# EAGLE design BT AQ DOL R4 (EAGLE 9.6.2)
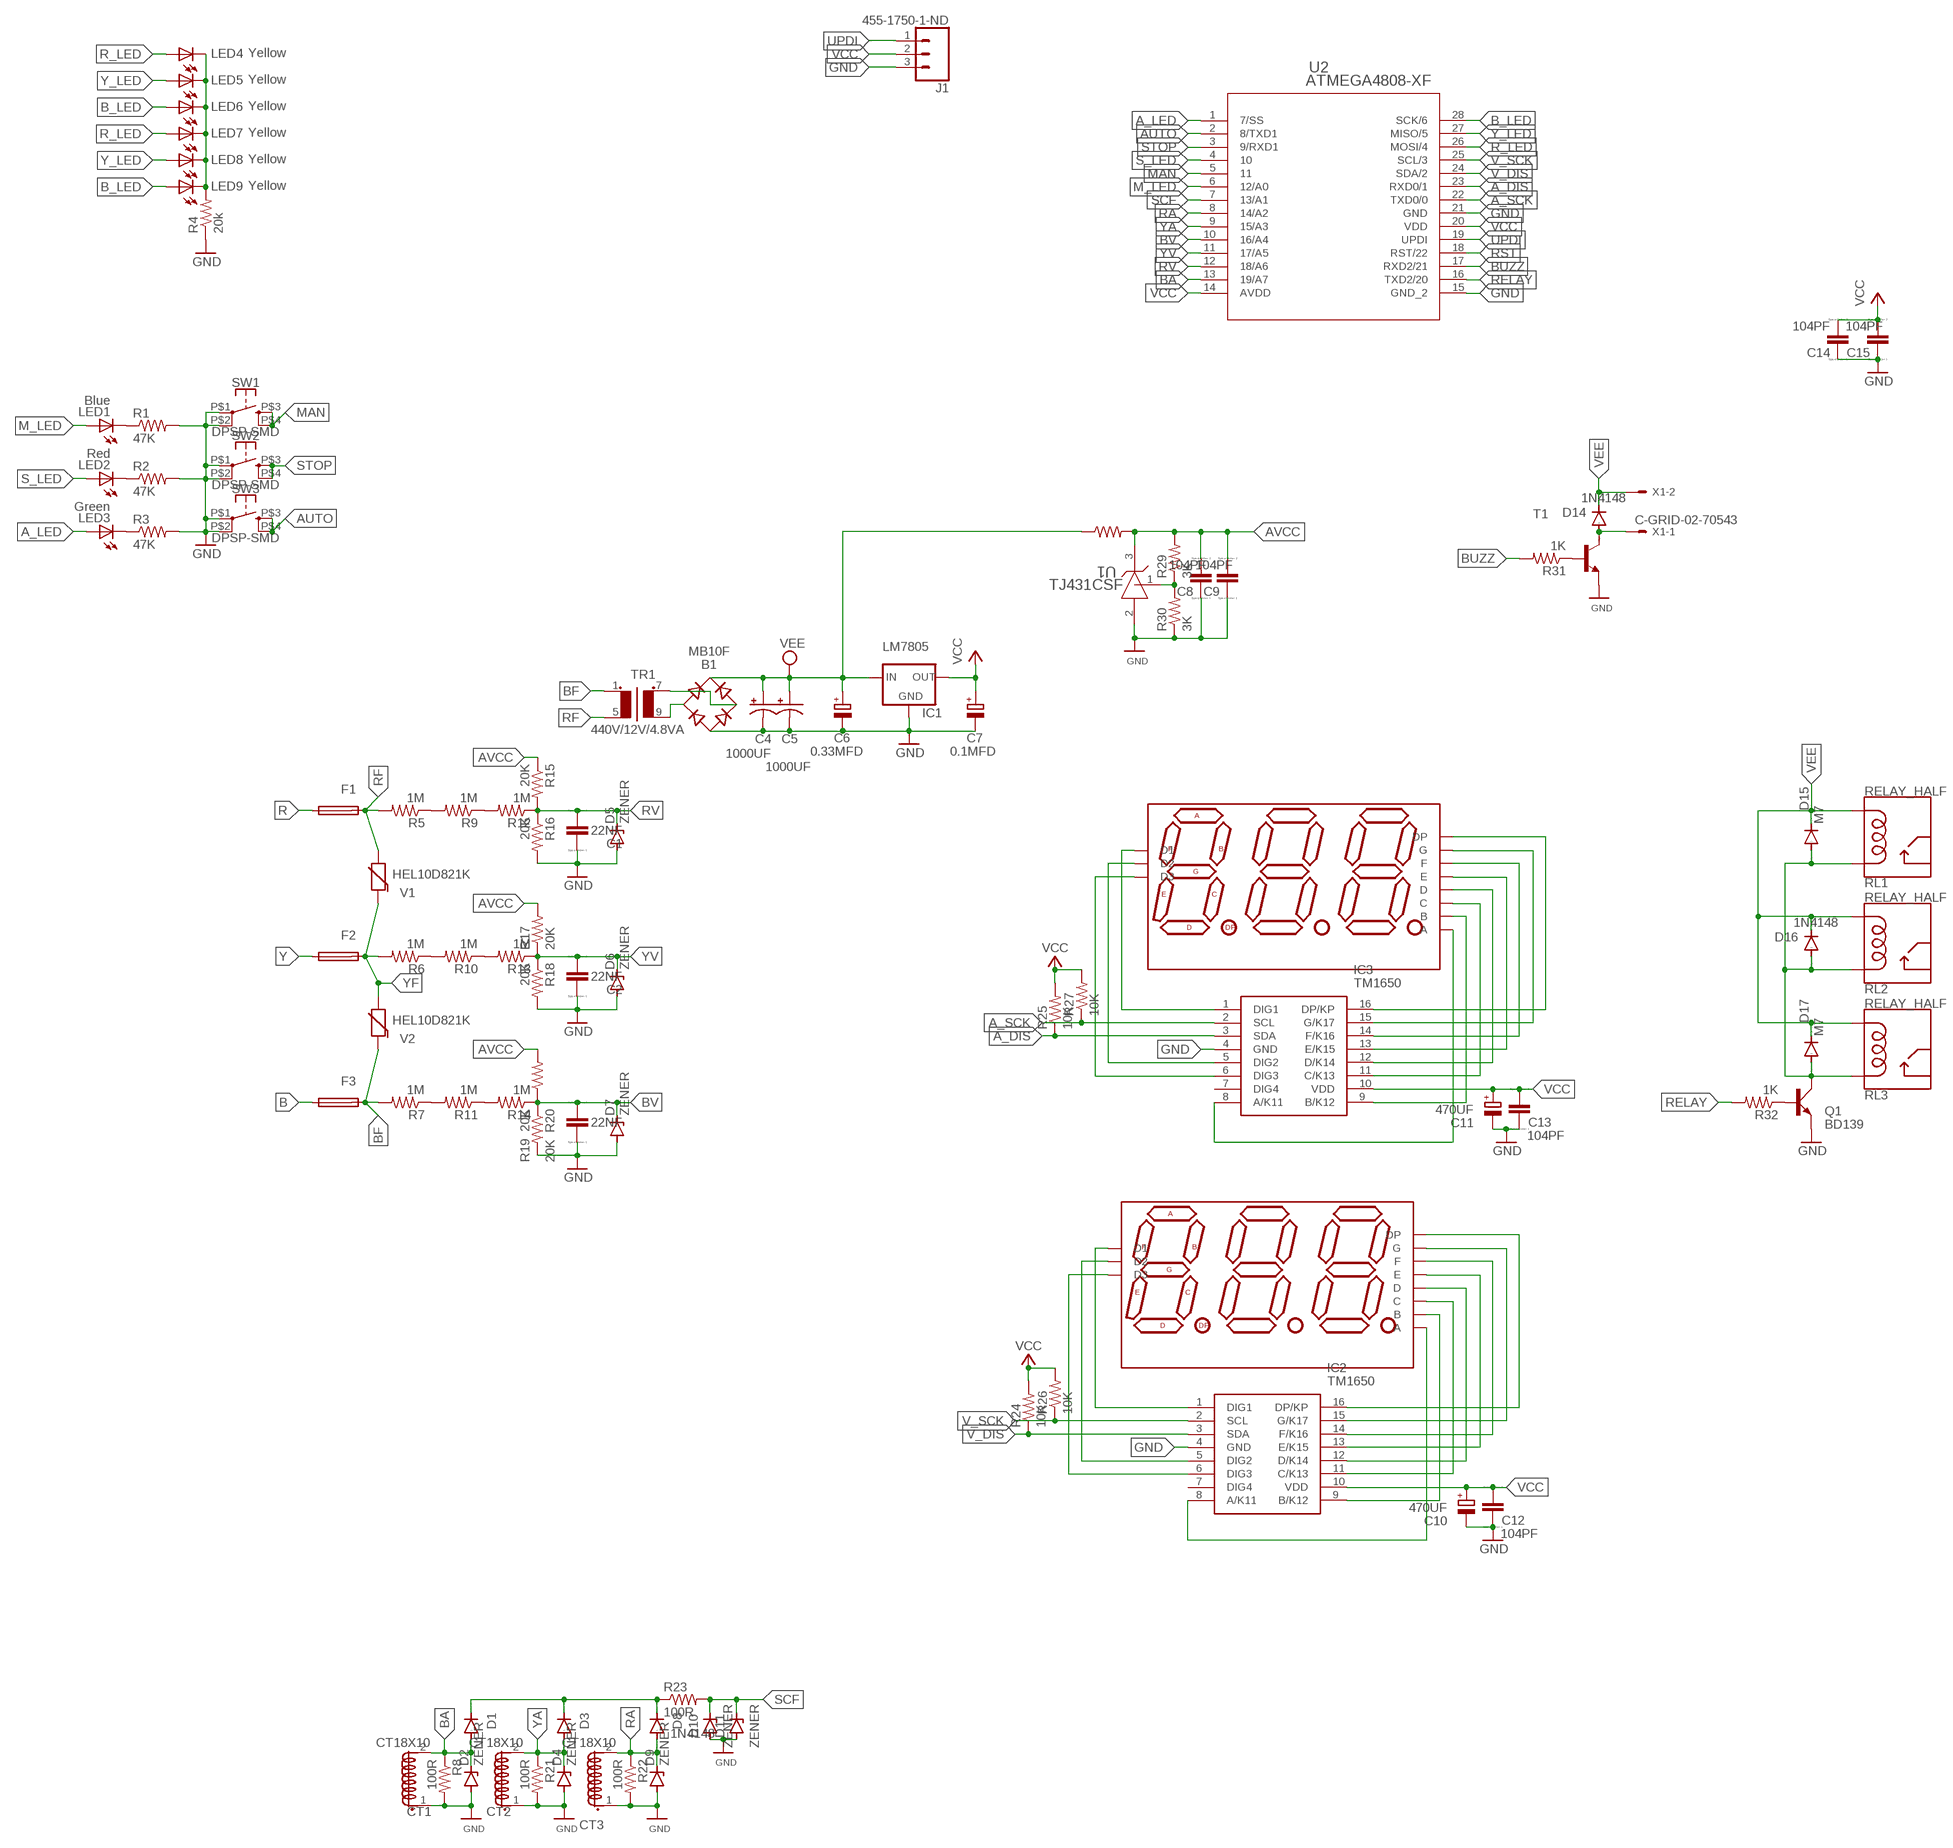
[diagram p0: schematic, sheet 1]

## Parts
B1  MB10F  MB8S  [SOIC-4]
C1  22NF  CC1206  [C1206]
C2  22NF  CC1206  [C1206]
C3  22NF  CC1206  [C1206]
C4  1000UF  CPOL-USE3.5-10  [E3,5-10]
C5  1000UF  CPOL-USE3.5-10  [E3,5-10]
C6  0.33MFD  CPOL-EUE2.5-5  [E2,5-5]
C7  0.1MFD  CPOL-EUE2.5-5  [E2,5-5]
C8  104PF  CC1206  [C1206]
C9  104PF  CC1206  [C1206]
C10  470UF  CPOL-EUE3.5-8  [E3,5-8]
C11  470UF  CPOL-EUE3.5-8  [E3,5-8]
C12  104PF  CC1206  [C1206]
C13  104PF  CC1206  [C1206]
C14  104PF  CC1206  [C1206]
C15  104PF  CC1206  [C1206]
CT1  CT18X10  [ZMCT103C]
CT2  CT18X10  [ZMCT103C]
CT3  CT18X10  [ZMCT103C]
D1  1N4148  DIODE-MINIMELF  [MINIMELF]
D2  ZENER  ZENER__DO-215-BA  [SOD6126X350]
D3  1N4148  DIODE-MINIMELF  [MINIMELF]
D4  ZENER  ZENER__DO-215-BA  [SOD6126X350]
D5  ZENER  ZENER__DO-215-BA  [SOD6126X350]
D6  ZENER  ZENER__DO-215-BA  [SOD6126X350]
D7  ZENER  ZENER__DO-215-BA  [SOD6126X350]
D8  1N4148  DIODE-MINIMELF  [MINIMELF]
D9  ZENER  ZENER__DO-215-BA  [SOD6126X350]
D10  ZENER  ZENER__DO-215-BA  [SOD6126X350]
D11  ZENER  ZENER__DO-213AA(SOD-80)  [DIOMELF3516]
D12  SUNR036CC3D  7SEGMENT-3DIGITDIP  [7S3D036_DIP]
D13  SUNR036CC3D  7SEGMENT-3DIGITDIP  [7S3D036_DIP]
D14  1N4148  DIODE-MINIMELF  [MINIMELF]
D15  M7  DIODE-DO-214AC  [DO-214AC]
D16  1N4148  DIODE-MINIMELF  [MINIMELF]
D17  M7  DIODE-DO-214AC  [DO-214AC]
F1  TRF600-150  PPTCPTH  [TRF600-150]
F2  TRF600-150  PPTCPTH  [TRF600-150]
F3  TRF600-150  PPTCPTH  [TRF600-150]
IC1  LM7805  78XXS  [78XXS]
IC2  TM1650  [SOIC127P604X185-16N]
IC3  TM1650  [SOIC127P604X185-16N]
J1  455-1750-1-ND  CONN_03  [1X03]
LED1  Blue  LED3MM  [LED3MM]
LED2  Red  LED3MM  [LED3MM]
LED3  Green  LED3MM  [LED3MM]
LED4  Yellow  LED3MM  [LED3MM]
LED5  Yellow  LED3MM  [LED3MM]
LED6  Yellow  LED3MM  [LED3MM]
LED7  Yellow  LED3MM  [LED3MM]
LED8  Yellow  LED3MM  [LED3MM]
LED9  Yellow  LED3MM  [LED3MM]
Q1  BD139  [TO126AV]
R1  47K  R-US_M1206  [M1206]
R2  47K  R-US_M1206  [M1206]
R3  47K  R-US_M1206  [M1206]
R4  20k  R-US_M1206  [M1206]
R5  1M  R-US_M1206  [M1206]
R6  1M  R-US_M1206  [M1206]
R7  1M  R-US_M1206  [M1206]
R8  100R  R-US_M1206  [M1206]
R9  1M  R-US_M1206  [M1206]
R10  1M  R-US_M1206  [M1206]
R11  1M  R-US_M1206  [M1206]
R12  1M  R-US_M1206  [M1206]
R13  1M  R-US_M1206  [M1206]
R14  1M  R-US_M1206  [M1206]
R15  20K  R-US_M1206  [M1206]
R16  20K  R-US_M1206  [M1206]
R17  20K  R-US_M1206  [M1206]
R18  20K  R-US_M1206  [M1206]
R19  20K  R-US_M1206  [M1206]
R20  20K  R-US_M1206  [M1206]
R21  100R  R-US_M1206  [M1206]
R22  100R  R-US_M1206  [M1206]
R23  100R  R-US_M1206  [M1206]
R24  10K  R-US_M1206  [M1206]
R25  10K  R-US_M1206  [M1206]
R26  10K  R-US_M1206  [M1206]
R27  10K  R-US_M1206  [M1206]
R28  10K  R-US_M1206  [M1206]
R29  3K  R-US_M1206  [M1206]
R30  3K  R-US_M1206  [M1206]
R31  1K  R-US_M1206  [M1206]
R32  1K  R-US_M1206  [M1206]
RL1  RELAY_HALF  [DT90_HALF]
RL2  RELAY_HALF  [DT90_HALF]
RL3  RELAY_HALF  [DT90_HALF]
SW1  DPSP-SMD  [B3F-40XX-ROUND-SMD]
SW2  DPSP-SMD  [B3F-40XX-ROUND-SMD]
SW3  DPSP-SMD  [B3F-40XX-ROUND-SMD]
T1  MMUN2213LT1-NPN-SC59-BEC  [SC59-BEC]
TR1  440V/12V/4.8VA  TRANSFORMER6VA  [440V12V6VA]
U1  TJ431CSF  TJ431CSFDBZ0003A_L  [SOT-23]
U2  ATMEGA4808-XF  [SSOP28_SS_MCH]
V1  HEL10D821K  VARISTOR  [10MM]
V2  HEL10D821K  VARISTOR  [10MM]
X1  C-GRID-02-70543  [70543-02]

## Nets
A_DIS: IC3.3(SDA) R25.1 U2.23(RXD0/1)
A_LED: LED3.A U2.1(7/SS)
A_SCK: IC3.2(SCL) R27.1 U2.22(TXD0/0)
AUTO: SW3.P$3 SW3.P$4 U2.2(8/TXD1)
AVCC: C8.2 C9.2 R15.1 R17.2 R19.2 R28.2 R29.2 U1.3(CATHODE)
B: F3.1
B_LED: LED6.A LED9.A U2.28(SCK/6)
BA: CT1.2(S1.2) D1.A D2.1(C) R8.1 U2.13(19/A7)
BF: F3.2 R7.2 TR1.1 V2.1
BUZZ: R31.2 U2.17(RXD2/21)
BV: C3.2 D7.1(C) R14.1 R19.1 R20.1 U2.10(16/A4)
GND: B1.- C1.1 C2.1 C3.1 C4.- C5.- C6.- C7.- C8.1 C9.1 C10.- C11.- C12.1 C13.1 C14.1 C15.1 CT1.1(S1.1) CT2.1(S1.1) CT3.1(S1.1) D2.2(A) D4.2(A) D5.2(A) D6.2(A) D7.2(A) D9.2(A) D10.2(A) D11.2(A) IC1.GND IC2.4(GND) IC3.4(GND) J1.3 Q1.E R1.2 R2.2 R3.2 R4.1 R8.2 R16.2 R18.2 R20.2 R21.2 R22.2 R30.1 SW1.P$1 SW1.P$2 SW2.P$1 SW2.P$2 SW3.P$1 SW3.P$2 T1.E U1.2(ANODE) U2.15(GND_2) U2.21(GND)
M_LED: LED1.A U2.6(12/A0)
MAN: SW1.P$3 SW1.P$4 U2.5
N$1: B1.~2(AC2) TR1.7(S1)
N$2: B1.~1(AC1) TR1.9(S2)
N$3: D14.A T1.C X1.1
N$4: R31.1 T1.B
N$5: LED3.K(C) R3.1
N$6: LED2.K(C) R2.1
N$8: LED1.K(C) R1.1
N$9: R29.1 R30.2 U1.1(REF)
N$10: LED4.K(C) LED5.K(C) LED6.K(C) LED7.K(C) LED8.K(C) LED9.K(C) R4.2
N$11: D1.C D3.C D8.C R23.1
N$13: R5.1 R9.2
N$14: R9.1 R12.2
N$15: R6.1 R10.2
N$18: R7.1 R11.2
N$19: R10.1 R13.2
N$22: Q1.B R32.1
N$23: R11.1 R14.2
N$28: D13.11(A) IC3.8(A/K11)
N$29: D13.7(B) IC3.9(B/K12)
N$30: D13.4(C) IC3.11(C/K13)
N$31: D13.2(D) IC3.12(D/K14)
N$32: D13.1(E) IC3.13(E/K15)
N$33: D13.10(F) IC3.14(F/K16)
N$34: D13.5(G) IC3.15(G/K17)
N$35: D13.3(DP) IC3.16(DP/KP)
N$36: D13.12(D1) IC3.1(DIG1)
N$37: D13.9(D2) IC3.5(DIG2)
N$38: D13.8(D3) IC3.6(DIG3)
N$39: D12.11(A) IC2.8(A/K11)
N$40: D12.7(B) IC2.9(B/K12)
N$41: D12.4(C) IC2.11(C/K13)
N$44: D12.2(D) IC2.12(D/K14)
N$48: D12.1(E) IC2.13(E/K15)
N$49: D12.10(F) IC2.14(F/K16)
N$50: D12.5(G) IC2.15(G/K17)
N$51: D12.3(DP) IC2.16(DP/KP)
N$52: D12.12(D1) IC2.1(DIG1)
N$53: D12.9(D2) IC2.5(DIG2)
N$54: D12.8(D3) IC2.6(DIG3)
N$121: D15.A D16.A D17.A Q1.C RL1.1(COIL1) RL2.1(COIL1) RL3.1(COIL1)
R: F1.1
R_LED: LED4.A LED7.A U2.26(MOSI/4)
RA: CT3.2(S1.2) D8.A D9.1(C) R22.1 U2.8(14/A2)
RELAY: R32.2 U2.16(TXD2/20)
RF: F1.2 R5.2 TR1.5(P2) V1.2
RST: U2.18(RST/22)
RV: C1.2 D5.1(C) R12.1 R15.2 R16.1 U2.12(18/A6)
S_LED: LED2.A U2.4
SCF: D10.1(C) D11.1(C) R23.2 U2.7(13/A1)
STOP: SW2.P$3 SW2.P$4 U2.3(9/RXD1)
UPDI: J1.1 U2.19(UPDI)
V_DIS: IC2.3(SDA) R24.1 U2.24(SDA/2)
V_SCK: IC2.2(SCL) R26.1 U2.25(SCL/3)
VCC: C7.+ C10.+ C11.+ C12.2 C13.2 C14.2 C15.2 IC1.OUT IC2.10(VDD) IC3.10(VDD) J1.2 R24.2 R25.2 R26.2 R27.2 U2.14(AVDD) U2.20(VDD)
VEE [VEE]: B1.+ C4.+ C5.+ C6.+ D14.C D15.C D16.C D17.C IC1.IN R28.1 RL1.2(COIL2) RL2.2(COIL2) RL3.2(COIL2) X1.2
Y: F2.1
Y_LED: LED5.A LED8.A U2.27(MISO/5)
YA: CT2.2(S1.2) D3.A D4.1(C) R21.1 U2.9(15/A3)
YF: F2.2 R6.2 V1.1 V2.2
YV: C2.2 D6.1(C) R13.1 R17.1 R18.1 U2.11(17/A5)
Unconnected: IC2.7(DIG4) IC3.7(DIG4)

## Library data of the parts
B1 = rectifier:MB*S: Bridge Rectifier Source: http://www.fairchildsemi.com/ds/MB/MB6S.pdf
C1-C3 C8 C9 C12-C15 = eagle-ltspice:C: CAPACITOR, European symbol; SPICEMODEL: NONE; SPICEPREFIX: C
C4 C5 = rcl:CPOL-US: POLARIZED CAPACITOR, American symbol; SPICEPREFIX: C
C6 C7 C10 C11 = rcl:CPOL-EU: POLARIZED CAPACITOR, European symbol; SPICEPREFIX: C
CT1-CT3 = User Components:CT
D1 D3 D8 D14-D17 = diode:DIODE-: DIODE
D2 D4-D7 D9-D11 = Tinkercad:ZENER: Zener Diode - Generic; CATEGORY: Diode; SUB-CATEGORY: Zener
D12 D13 = User Components:7SEGMENT-3DIGIT
F1-F3 = User Components:PPTC: FUSE Wickmann; OC_FARNELL: unknown; OC_NEWARK: unknown
IC1 = v-reg:78XXS: VOLTAGE REGULATOR
IC2 IC3 = User Components:TM1650: The TM1650 is a dedicated LED (LED display) drive control circuit with a keyboard scan interface. The MCU input and output control digital interface, data latch, LED driver, keyboard scan, brightness adjustment and other circuits are integrated inside. The TM1650's stable performance, reliable quality, and high immunity to interference make it suitable for long-term continuous operation in 24 hours Source: Datasheet <http://www.titanmec.com/index.php/en/product/download/id/540.html>; DESCRIPTION: The TM1650 is a dedicated LED (LED display) drive control circuit with a keyboard scan interface. The MCU input and output control digital interface, data latch, LED driver, keyboard scan, brightness adjustment and other circuits are integrated inside. The TM1650's stable performance, reliable quality, and high immunity to interference make it suitable for long-term continuous operation in 24 hours; HEIGHT: 1.85mm; MANUFACTURER_NAME: TITAN MICRO ELECTRONICS; MANUFACTURER_PART_NUMBER: tm1650
J1 = SparkFun-Connectors:CONN_03: Multi connection point. Often used as Generic Header-pin footprint for 0.1 inch spaced/style header connections On any of the 0.1 inch spaced packages, you can populate with these: Break Away Headers - Straight <https://www.sparkfun.com/products/116> (PRT-00116) Break Away Male Headers - Right Angle <https://www.sparkfun.com/products/553> (PRT-00553) Female Headers <https://www.sparkfun.com/products/115> (PRT-00115) Break Away Headers - Machine Pin <https://www.sparkfun.com/products/117> (PRT-00117) Break Away Female Headers - Swiss Machine Pin <https://www.sparkfun.com/products/743> (PRT-00743) Stackable Header - 3 Pin (Female, 0.1") <https://www.sparkfun.com/products/13875> (PRT-13875) For SCREWTERMINALS and SPRING TERMINALS visit here: Screw Terimnals on SparkFun.com <https://www.sparkfun.com/search/results?term=Screw+Terminals> (5mm/3.5mm/2.54mm spacing) This device is also useful as a general connection point to wire up your design to another part of your project. Our various solder wires solder well into these plated through hole pads. Hook-Up Wire - Assortment (Stranded, 22 AWG) <https://www.sparkfun.com/products/11375> (PRT-11375) Hook-Up Wire - Assortment (Solid Core, 22 AWG) <https://www.sparkfun.com/products/11367> (PRT-11367) View the entire wire category on our website here <https://www.sparkfun.com/categories/141> Special notes: Molex polarized connector foot print use with SKU : PRT-08232 with associated crimp pins and housings.; PROD_ID: XXX-00000
LED1-LED9 = adafruit:LED: LED OSRAM: - CHIPLED LG R971, LG N971, LY N971, LG Q971, LY Q971, LO R971, LY R971 LH N974, LH R974 LS Q976, LO Q976, LY Q976 LO Q996 - Hyper CHIPLED LW Q18S LB Q993, LB Q99A, LB R99A - SideLED LS A670, LO A670, LY A670, LG A670, LP A670 LB A673, LV A673, LT A673, LW A673 LH A674 LY A675 LS A676, LA A676, LO A676, LY A676, LW A676 LS A679, LY A679, LG A679 - Hyper Micro SIDELED® LS Y876, LA Y876, LO Y876, LY Y876 LT Y87S - SmartLED LW L88C, LW L88S LB L89C, LB L89S, LG L890 LS L89K, LO L89K, LY L89K LS L896, LA L896, LO L896, LY L896 - TOPLED LS T670, LO T670, LY T670, LG T670, LP T670 LSG T670, LSP T670, LSY T670, LOP T670, LYG T670 LG T671, LOG T671, LSG T671 LB T673, LV T673, LT T673, LW T673 LH T674 LS T676, LA T676, LO T676, LY T676, LB T676, LH T676, LSB T676, LW T676 LB T67C, LV T67C, LT T67C, LS T67K, LO T67K, LY T67K, LW E67C LS E67B, LA E67B, LO E67B, LY E67B, LB E67C, LV E67C, LT E67C LW T67C LS T679, LY T679, LG T679 LS T770, LO T770, LY T770, LG T770, LP T770 LB T773, LV T773, LT T773, LW T773 LH T774 LS E675, LA E675, LY E675, LS T675 LS T776, LA T776, LO T776, LY T776, LB T776 LHGB T686 LT T68C, LB T68C - Hyper Mini TOPLED® LB M676 - Mini TOPLED Santana® LG M470 LS M47K, LO M47K, LY M47K Source: http://www.osram.convergy.de/
Q1 = transistor-power:BD139: NPN TRANSISTOR
R1-R7 R9-R20 R24-R27 R31 R32 = rcl:R-US_: RESISTOR, American symbol; SPICEPREFIX: R
R8 R21-R23 R28-R30 = rcl:R-US_: RESISTOR, American symbol
RL1-RL3 = User Components:RELAY_HALF
SW1-SW3 = User Components:DPSP-SMD
T1 = transistor:*-NPN-: NPN Transistror BF959 corrected 2008.03.06
TR1 = User Components:TRANSFORMER
U1 = User Components:TJ431CSF; COPYRIGHT: Copyright (C) 2022 Ultra Librarian. All rights reserved.; MANUFACTURER_PART_NUMBER: TL431IDBZTG4; MFR_NAME: Texas Instruments; REFDES: RefDes; TYPE: TYPE
U2 = User Components:ATMEGA4808-XF; COPYRIGHT: Copyright (C) 2022 Ultra Librarian. All rights reserved.; MANUFACTURER_PART_NUMBER: ATMEGA4808-XF; MFR_NAME: Microchip
V1 V2 = User Components:VARISTOR
X1 = con-molex:C-GRID-02: CONNECTOR wire to board 2.54 mm (0.100") pitch header; MF: MOLEX; OC_FARNELL: unknown; OC_NEWARK: unknown

## Net classes
0 default: width 0.254 mm, drill 0.508 mm, clearance 0.381 mm
1 VEE: width 0.762 mm, drill 0.508 mm, clearance 0.508 mm

## Board
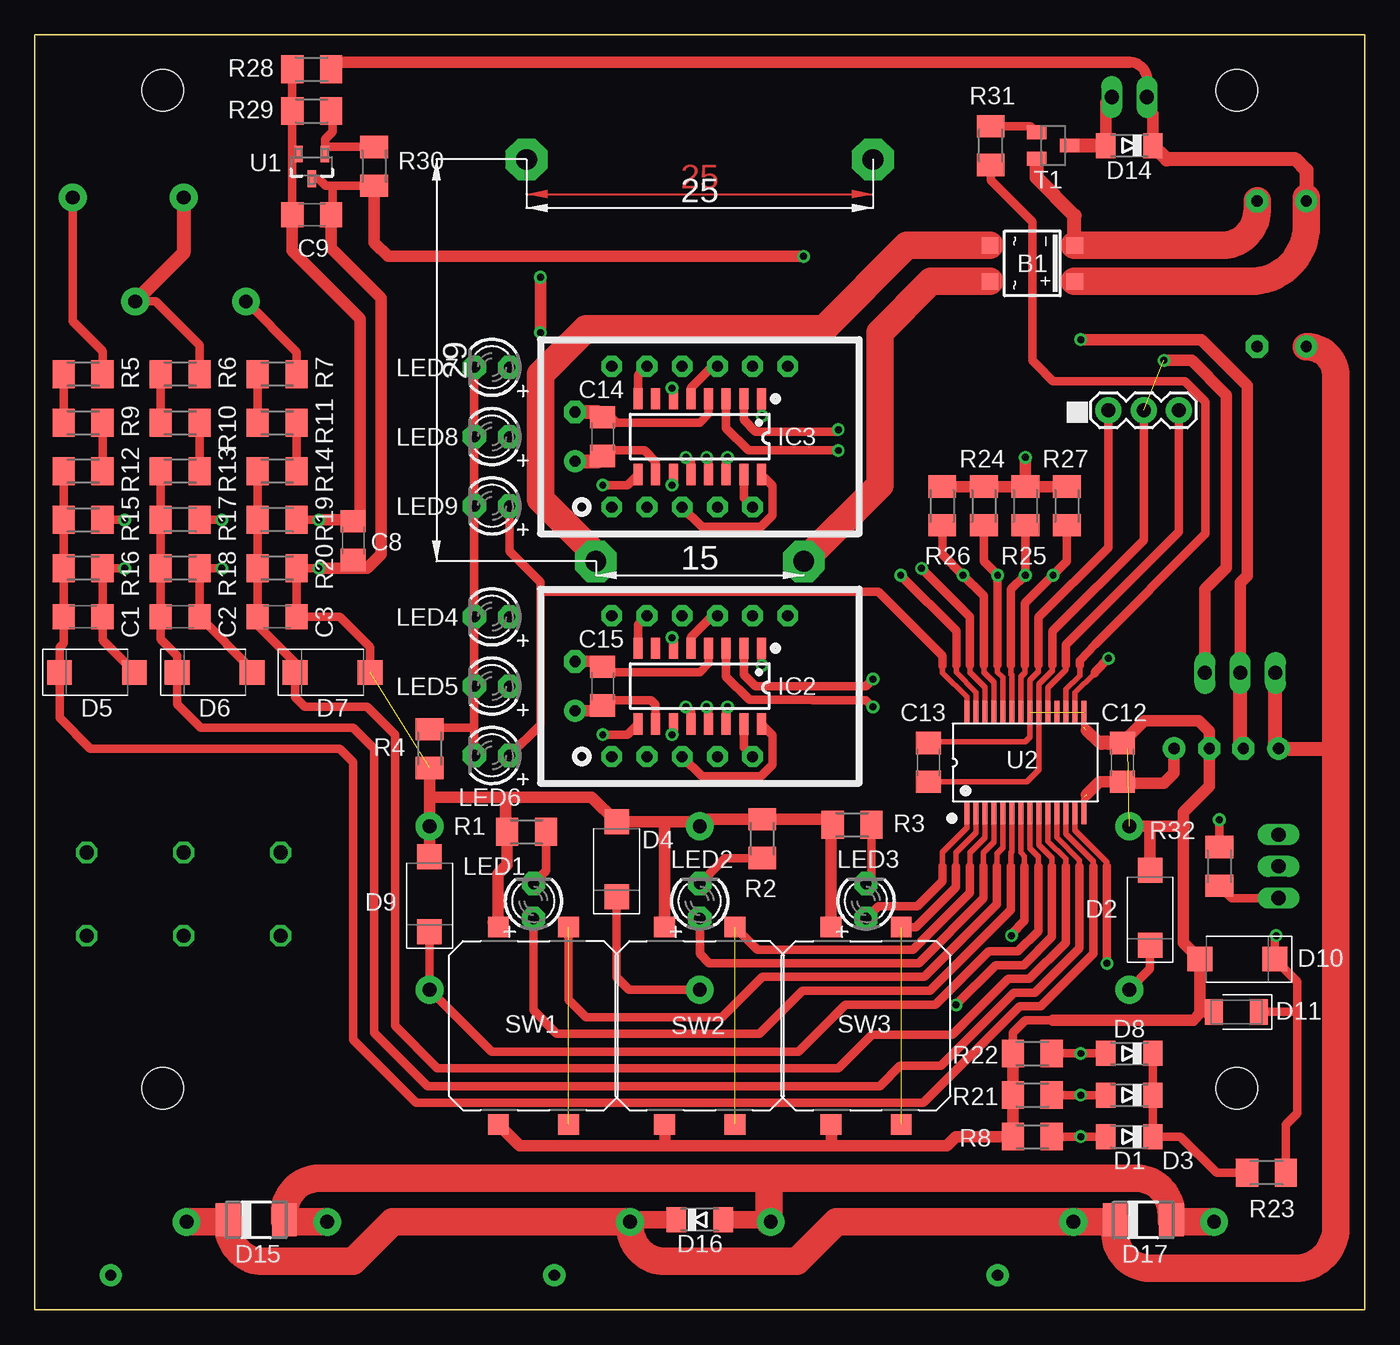
[diagram p1: board, top side]
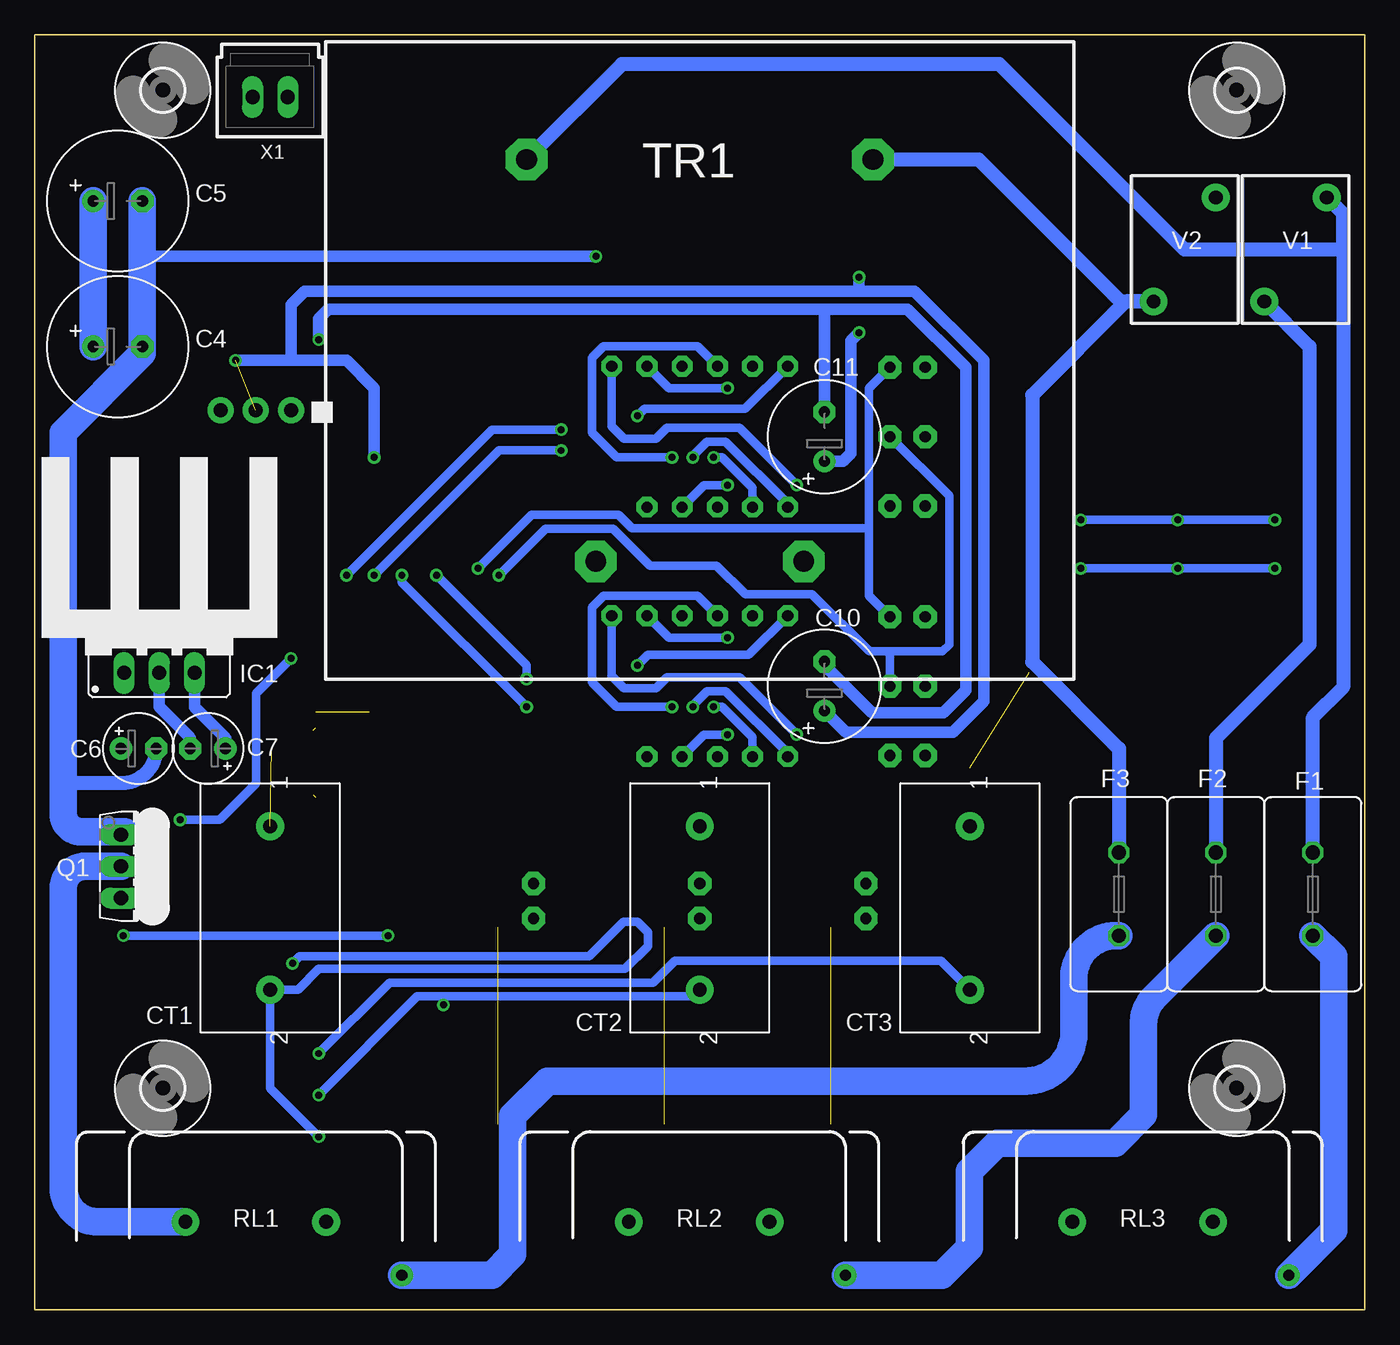
[diagram p2: board, bottom side, seen from below]

Size 96 x 92 mm. Coordinates in mm from the lower left corner, seen from the top.
Outline: 96,0 96,92 0,92 0,0 96,0
Copper layers (1*16): Top 0.035mm / dielectric 1.5mm / Bottom 0.035mm
Design rules "default *": minimum track width 6mil, minimum drill 0.35mm, track to track 6mil, track to pad 6mil, pad to pad 6mil, via to via 6mil, smd to smd 6mil, copper to edge 40mil, drill to drill 6mil, minimum pad ring 10mil, minimum via ring 8mil, stop-mask expansion 4mil, vias tented up to drill 20mil, thermal gap 10mil

### Footprints (pad centres in the part's own frame; a part is rotated, then mirrored left to right if it is on the bottom)
SOIC-4 = smd 1.2 x 1.2: + 1.3,3.05; - -1.3,3.05; ~1 -1.3,-3.05; ~2 1.3,-3.05
C1206 = smd 1.6 x 1.8: 1 -1.4,0; 2 1.4,0
E3,5-10 = drill 0.813 pad 1.6: + -1.778,0 | drill 0.813 pad 1.6 octagon: - 1.778,0
E2,5-5 = drill 0.813 pad 1.6: + -1.27,0 | drill 0.813 pad 1.6 octagon: - 1.27,0
E3,5-8 = drill 0.813 pad 1.6: + -1.778,0 | drill 0.813 pad 1.6 octagon: - 1.778,0
ZMCT103C = drill 1 pad 2: 1 -5.9,0; 2 5.9,0
MINIMELF = smd 1.4 x 1.8: A 1.7,0; C -1.7,0
SOD6126X350 = smd 1.798 x 1.769: 1 -2.705,0; 2 2.705,0
DIOMELF3516 = smd 1.275 x 1.85: 1 -1.62,0; 2 1.62,0
7S3D036_DIP = drill 0.8 pad 1.5 octagon: 1 -6.35,-5.08; 2 -3.81,-5.08; 3 -1.27,-5.08; 4 1.27,-5.08; 5 3.81,-5.08; 7 6.35,5.08; 8 3.81,5.08; 9 1.27,5.08; 10 -1.27,5.08; 11 -3.81,5.08; 12 -6.35,5.08
DO-214AC = smd 1.8 x 2.4: A 2.025,0; C -2.025,0
TRF600-150 = drill 1.016 octagon: 1 -3,0; 2 3,0
78XXS = drill 1.016 long: GND 0,-2.54; IN -2.54,-2.54; OUT 2.54,-2.54
SOIC127P604X185-16N = smd 1.53 x 0.65: 1 -2.735,4.445; 2 -2.735,3.175; 3 -2.735,1.905; 4 -2.735,0.635; 5 -2.735,-0.635; 6 -2.735,-1.905; 7 -2.735,-3.175; 8 -2.735,-4.445; 9 2.735,-4.445; 10 2.735,-3.175; 11 2.735,-1.905; 12 2.735,-0.635; 13 2.735,0.635; 14 2.735,1.905; 15 2.735,3.175; 16 2.735,4.445
1X03 = drill 1.016 pad 1.88: 1 0,0; 2 2.54,0; 3 5.08,0
LED3MM = drill 0.813 pad 1.676 octagon: A -1.27,0; K 1.27,0
TO126AV = drill 1.016 long: B 2.286,-1.27; C 0,-1.27; E -2.286,-1.27
M1206 = smd 1.6 x 2: 1 -1.4,0; 2 1.4,0
DT90_HALF = drill 1 pad 2: 1 -5.12,-0.15; 2 5.04,-0.15
B3F-40XX-ROUND-SMD = smd 1.5 x 1.5: P$1 -7.12,2.54; P$2 7.12,2.54; P$3 -7.12,-2.54; P$4 7.12,-2.54
SC59-BEC = smd 1 x 1.4: B -0.95,-1.2; C 0,1.2; E 0.95,-1.2
440V12V6VA = drill 1.5 pad 3 octagon: 1 -14.5,12.5; 5 -14.5,-12.5; 7 14.5,-7.5; 9 14.5,7.5
SOT-23 = smd 0.6 x 1.2: 1 -0.95,-0.9; 2 0,0.9; 3 0.95,-0.9
SSOP28_SS_MCH = smd 1.651 x 0.381: 1 -3.632,4.225; 2 -3.632,3.575; 3 -3.632,2.925; 4 -3.632,2.275; 5 -3.632,1.625; 6 -3.632,0.975; 7 -3.632,0.325; 8 -3.632,-0.325; 9 -3.632,-0.975; 10 -3.632,-1.625; 11 -3.632,-2.275; 12 -3.632,-2.925; 13 -3.632,-3.575; 14 -3.632,-4.225; 15 3.632,-4.225; 16 3.632,-3.575; 17 3.632,-2.925; 18 3.632,-2.275; 19 3.632,-1.625; 20 3.632,-0.975; 21 3.632,-0.325; 22 3.632,0.325; 23 3.632,0.975; 24 3.632,1.625; 25 3.632,2.275; 26 3.632,2.925; 27 3.632,3.575; 28 3.632,4.225
3,0 = hole 3: 0,0
10MM = drill 1 pad 2: 1 -3.75,2.25; 2 3.75,-2.25
70543-02 = drill 1.016 long: 1 -1.27,0; 2 1.27,0

### Placement (x,y rotation side)
B1  72,75.5 270 top
C1  3.5,50 180 top
C2  10.5,50 180 top
C3  17.5,50 180 top
C4  90,69.5 0 bottom
C5  90,80 0 bottom
C6  88.5,40.5 0 bottom
C7  83.5,40.5 180 bottom
C8  23,55.5 90 top
C9  20,79 180 top
C10  39,45 90 bottom
C11  39,63 90 bottom
C12  78.5,39.5 270 top
C13  64.5,39.5 270 top
C14  41,63 270 top
C15  41,45 270 top
CT1  79,29 270 bottom
CT2  48,29 270 bottom
CT3  28.5,29 270 bottom
D1  79,12.5 180 top
D2  80.5,29 90 top
D3  79,15.5 180 top
D4  42,32.5 90 top
D5  4.5,46 0 top
D6  13,46 0 top
D7  21.5,46 0 top
D8  79,18.5 180 top
D9  28.5,30 90 top
D10  86.8,25.3 180 top
D11  86.72,21.5 180 top
D12  48,45 0 top
D13  48,63 0 top
D14  79,84 180 top
D15  16,6.5 0 top
D16  48,6.5 0 top
D17  80,6.5 0 top
F1  3.75,30 90 bottom
F2  10.75,30 90 bottom
F3  17.75,30 90 bottom
IC1  87,48.5 0 bottom
IC2  48,45 270 top
IC3  48,63 270 top
J1  82.58,64.9 180 top
LED1  36,29.5 90 top
LED2  48,29.5 90 top
LED3  60,29.5 90 top
LED4  33,50 180 top
LED5  33,45 180 top
LED6  33,40 180 top
LED7  33,68 180 top
LED8  33,63 180 top
LED9  33,58 180 top
Q1  88.5,32 270 bottom
R1  35.5,34.5 180 top
R2  52.5,34 90 top
R3  59,35 180 top
R4  28.5,40.5 90 top
R5  3.5,67.5 0 top
R6  10.5,67.5 0 top
R7  17.5,67.5 0 top
R8  72,12.5 180 top
R9  3.5,64 180 top
R10  10.5,64 180 top
R11  17.5,64 180 top
R12  3.5,60.5 0 top
R13  10.5,60.5 0 top
R14  17.5,60.5 0 top
R15  3.5,57 180 top
R16  3.5,53.5 0 top
R17  10.5,57 0 top
R18  10.5,53.5 0 top
R19  17.5,57 0 top
R20  17.5,53.5 0 top
R21  72,15.5 180 top
R22  72,18.5 180 top
R23  88.9,9.9 0 top
R24  68.5,58 90 top
R25  71.5,58 90 top
R26  65.5,58 90 top
R27  74.5,58 90 top
R28  20,89.5 180 top
R29  20,86.5 180 top
R30  24.5,82.5 90 top
R31  69,84 270 top
R32  85.5,32 90 top
RL1  80,6.5 0 bottom
RL2  48,6.5 0 bottom
RL3  16,6.5 0 bottom
SW1  36,20.5 90 top
SW2  48,20.5 90 top
SW3  60,20.5 90 top
T1  73.5,84 270 top
TR1  48,68.5 270 bottom
U1  20,82.5 180 top
U2  71.5,39.5 90 top
U$1  [3,0]  86.75,16 0 bottom
U$2  [3,0]  9.25,16 0 bottom
U$3  [3,0]  86.75,88 0 bottom
U$4  [TO220_17X13]  87,55 0 bottom
U$8  [3,0]  9.25,88 0 bottom
V1  5,76.5 90 bottom
V2  13,76.5 90 bottom
X1  79,87.5 180 bottom

### Tracks (layer width: path | path; a pad name or v marks a point on that pad's centre or on a via)
A_DIS  (via drill 0.5 pad 0.9)
  Top 0.38: 70.47,46.5 70.47,45.86 70.53,45.8 U2.23
  Top 0.61: IC3.3 49.91,63.59 51.5,62 v58,62 | 70.47,46.5 70.47,51.97 v71.5,53 R25.1
  Bottom 0.61: v58,62 62.5,62 v71.5,53
A_LED
  Top 0.38: U2.1 67.28,34.77 65.5,33 65.5,32
  Top 0.61: LED3.A 60.88,29.11 63.7,29.11 65.5,30.91 65.5,32
A_SCK  (via drill 0.5 pad 0.9)
  Top 0.38: U2.22 71.17,45.26 71.17,45.67 71.46,45.96 71.46,46.5
  Top 0.61: IC3.2 51.17,64.21 52.03,63.36 57.86,63.36 v58,63.5 | 71.46,46.5 71.46,50.96 v73.5,53 74.5,54 R27.1
  Bottom 0.61: v58,63.5 63,63.5 v73.5,53
AUTO  (1 unrouted)
  Top 0.38: U2.2 67.92,34.42 66.49,32.99 66.49,32
  Top 0.61: SW3.P$4 63.61,27.62 66.49,30.5 66.49,32
AVCC  (via drill 0.5 pad 0.9)
  Top 0.61: v6.5,57 R15.1 | v13.5,57 R17.2 | v20.5,57 R19.2 | 18.6,83.5 R29.2 R28.2 | 18.6,83.5 C9.2 | U1.3 18.7,83.4 18.6,83.5
  Top 0.813: C9.2 18.6,76.4 23.5,71.5 23.5,57.4 C8.2 23.1,57 v20.5,57
  Bottom 0.61: v6.5,57 v13.5,57 v20.5,57
B  (via drill 0.8 pad 1.6)
  Bottom 2: F3.1 17.96,27 arc-90 21,23.96 21,20 arc90 24.5,16.5 59,16.5 61.5,14 61.5,4 63,2.5 v69.5,2.5
B_LED
  Top 0.38: U2.28 67.28,44.23 65.52,45.98 65.52,46.48
  Top 0.61: LED9.A 34.27,54.73 36.5,52.5 36.5,52 | LED6.A 36.5,42.23 36.5,52 | 65.52,46.48 65.52,47.18 60.88,51.81 36.69,51.81 36.5,52
BA  (via drill 0.5 pad 0.9, 0.51)
  Top 0.38: U2.13 75.08,34.6 77.39,32.29 77.39,32
  Top 0.61: 77.39,32 v77.39,25 | R8.1 v75.5,12.5 D1.A | D2.1 80.5,24.6 CT1.2
  Bottom 0.61: v77.39,25 76.89,25.5 56,25.5 53.5,28 52.5,28 51.75,27.25 51.75,26.25 53.4,24.6 75.5,24.6 77,23.1 CT1.2 79,16 v75.5,12.5
BF
  Top 0.61: V2.1 18.9,69.1 R7.2
  Bottom 1: F3.2 17.75,40.5 24,46.75 24,66 17.25,72.75 V2.1 17.64,72.75 27.89,83 TR1.1
BUZZ
  Top 0.38: U2.17 74.42,44.77 75.42,45.77 75.42,46.5
  Top 0.61: 75.42,46.5 75.42,46.84 76.5,48 84.5,56 84.5,65.5 83,67 73.5,67 72.25,68.25 72,68.5 72,78.5 69,81.5 R31.2
BV
  Top 0.38: U2.10 73.12,33.82 74.42,32.53 74.42,32
  Top 0.61: R14.1 R19.1 R20.1 C3.2 16.1,49.4 18.8,46.7 D7.1 18.8,44.2 19.5,43.5 24,43.5 26,41.5 26,20.5 29.06,17.44 58,17.44 60.41,19.86 66.25,19.86 70.27,23.88 71.79,23.88 74.42,26.5 74.42,32
GND  (via drill 0.5 pad 0.9)  (4 unrouted)
  Top 0.38: 72.45,46.5 72.45,46.04 71.83,45.41 U2.21 71.83,41.33 71.5,41 64.6,41 C13.1 | 75.72,42 U2.15 | C12.1 77.5,40.9
  Top 0.61: IC3.4 48.63,64.64 48,64 42,64 41.6,64.4 C14.1 | IC2.4 48.63,46.63 48,46 41.4,46 C15.1 | 72.45,46.5 72.45,49.95 77.5,55 J1.3 | 21.5,79.5 21.5,79 C9.1 21.5,79.1 21.5,81.1 | R30.1 21.5,81.1 | 21.5,81.1 21,81.1 20.5,81.6 U1.2 | v6.5,53.5 R16.2 C1.1 4.9,48.3 D5.2 | C2.1 R18.2 v13.5,53.5 | v20.5,53.5 R20.2 C3.1 22,50 24.2,47.8 D7.2 | C2.1 12.05,50 | R22.2 70.6,20.01 71.5,20.91 73.5,20.91 | D10.2 83.8,25.3 | 84.2,21.5 84.09,21.39 | C2.1 15.71,46.2 D6.2
  Top 0.813: 78.9,40.5 C12.1 80.1,42.5 84,42.5 84.77,41.73 C7.- 84.77,37.77 82.9,35.9 82.9,26.5 D10.2 84.09,21.39 83.61,20.91 73.5,20.91 | 57.58,13.5 SW3.P$1 57.5,13.34 57.5,11.84 | SW2.P$2 45.46,35.16 45.5,35.2 | 33.1,27.98 SW1.P$2 33.46,31.46 34.1,32.1 R1.2 34,34.6 34,37 | C6.- 87,40.5 | v75.5,70 84.19,70 87.5,66.69 87.5,52.96 87,52.46 IC1.GND | C15.1 40.62,46.78 C10.- | 57.46,35.14 R3.2 | R30.1 24.5,77 25.5,76 v55.5,76 | C9.1 21.4,76.6 25,73 25,54.5 24,53.5 23,53.5 | 57.6,27.76 SW3.P$2 57.46,35.14 | 57.46,35.14 57.2,35.4 R2.2 48.5,35.4 CT2.1 | v20.5,53.5 23,53.5 | C8.1 23,53.5 | R4.1 28.5,37 | 34,37 28.5,37 | CT1.1 80.5,34.9 | 80.5,34.9 83,34.9 | 77,40.9 76.83,40.9 75.9,41.83 | 57.5,11.84 45.5,11.84 | 45.5,11.84 35,11.84 SW1.P$1 | SW2.P$1 45.5,13.34 45.5,11.84 | 57.5,11.84 65.84,11.84 66.5,12.5 R8.2 R21.2 R22.2 | D11.2 84.2,21.5 | 28.5,37 CT3.1 D9.2 | CT2.1 47.96,34.86 47.62,35.2 45.5,35.2 | 80.5,31.55 D2.2 80.5,34.9 | 34,37 40.2,37 D4.2 45.5,35.2 | 47.7,35.2 CT2.1
  Top 1.016: B1.- 75.05,78.95 72.3,81.7 T1.E | 87,40.5 IC1.GND | C11.- 40.62,64.78 C14.1 | 77.5,40.9 77,40.9
  Top 2: B1.- 85.68,76.8 arc90 88.22,79.34 C5.-
  Bottom 0.508: Q1.E 92.43,34.29 92.65,34.5
  Bottom 0.61: v6.5,53.5 v13.5,53.5 v20.5,53.5
  Bottom 0.813: IC1.GND 87,43.5 84.77,41.27 C7.- | 39,72.19 33.01,72.19 28.81,67.99 28.81,44.69 30.43,43.07 35.57,43.07 39,46.5 C10.- | 39,72.19 C11.- | v55.5,76 88.22,76 | v75.5,70 75.5,71.5 74.81,72.19 39,72.19
  Bottom 1.016: C6.- arc90 89.73,38 93.93,38
  Bottom 2: C5.- 88.22,76 C4.- 88.22,69 93.93,63.29 93.93,38 93.93,35.79 arc-90 92.65,34.5 89.5,34.5
M_LED
  Top 0.38: U2.6 70.53,33.06 70.45,32.99 70.45,32
  Top 0.61: 70.45,32 70.45,28.86 64.62,23.03 55.43,23.03 52.33,19.92 37.68,19.92 36,21.6 LED1.A
MAN  (1 unrouted)
  Top 0.38: U2.5 69.88,33.33 69.46,32.91 69.46,32
  Top 0.61: 69.46,32 69.46,29.27 64.21,24.02 52.52,24.02 49.61,21.11 39.8,21.11 38.54,22.37 SW1.P$4
N$1
  Top 2: B1.~2 64.7,74.2 61,70.5 61,59.5 TR1.7
N$2
  Top 2: TR1.9 40,55 36.5,58.5 36.5,67.5 39.8,70.8 56.95,70.8 62.95,76.8 B1.~1
N$3
  Top 0.813: X1.1 77.3,87.07 D14.A
  Top 1.016: D14.A T1.C
N$4
  Top 0.61: R31.1 71.85,85.4 T1.B
N$5
  Top 0.61: LED3.K 60.4,31.17 R3.1
N$6
  Top 0.61: LED2.K 49.83,32.6 R2.1
N$8
  Top 0.61: LED1.K 36.9,31.67 R1.1
N$9
  Top 0.61: U1.1 20.95,84 | 20.95,84 20.95,84.45 21.5,85 21.5,86.4 R29.1 | R30.2 21.05,83.9 20.95,84
N$10
  Top 0.61: LED7.K LED8.K LED9.K LED4.K LED5.K 31.73,42 | 31.73,42 LED6.K | R4.2 28.6,42 31.73,42
N$11
  Top 0.61: D8.C D3.C D1.C 82.7,12.5 85.3,9.9 R23.1
N$13
  Top 0.61: R5.1 R9.2
N$14
  Top 0.61: R12.2 R9.1
N$15
  Top 0.61: R10.2 R6.1
N$18
  Top 0.61: R7.1 R11.2
N$19
  Top 0.61: R10.1 R13.2
N$22
  Top 0.61: R32.1 86.39,29.71 Q1.B
N$23
  Top 0.61: R14.2 R11.1
N$28
  Top 0.61: D13.11 43.55,67.44 IC3.8
N$29  (via drill 0.5 pad 0.9)
  Top 0.61: IC3.9 42.79,59.5 v41,59.5
  Bottom 0.61: D13.7 54.35,63.73 53.47,62.86 51.14,62.86 50.37,63.63 45.13,63.63 v41,59.5
N$30  (via drill 0.5 pad 0.9)
  Top 0.61: IC3.11 46.09,59.59 v46,59.5
  Bottom 0.61: v46,59.5 47.69,59.5 D13.4
N$31  (via drill 0.5 pad 0.9)
  Top 0.61: IC3.12 47.37,61.02 47.36,61.03 47.36,61.14 v47,61.5
  Bottom 0.61: v47,61.5 46.38,61.5 44.19,59.31 D13.2
N$32  (via drill 0.5 pad 0.9)
  Top 0.61: IC3.13 48.63,61.37 v48.5,61.5
  Bottom 0.61: D13.1 41.65,58.17 46.13,62.64 47.47,62.64 48.5,61.62 v48.5,61.5
N$33  (via drill 0.5 pad 0.9)
  Top 0.61: IC3.14 49.91,61.41 v50,61.5
  Bottom 0.61: D13.10 48.17,69.52 54.95,69.52 55.79,68.67 55.79,63.27 54.02,61.5 v50,61.5
N$34
  Top 0.61: D13.5 51.17,58.55 IC3.15
N$35
  Top 0.61: IC3.16 53.25,59.46 53.25,57.33 52.41,56.48 48.17,56.48 D13.3
N$36  (via drill 0.5 pad 0.9)
  Top 0.61: v52.5,64.5 52.45,64.56 IC3.1
  Bottom 0.61: v52.5,64.5 52,65 44.73,65 D13.12
N$37
  Top 0.61: D13.9 48.92,68.08 47.37,66.53 IC3.5
N$38  (via drill 0.5 pad 0.9)
  Top 0.61: IC3.6 46.09,66.41 v46,66.5
  Bottom 0.61: v46,66.5 50.23,66.5 D13.8
N$39
  Top 0.61: IC2.8 43.55,49.45 D12.11
N$40  (via drill 0.5 pad 0.9)
  Top 0.61: IC2.9 42.79,41.5 v41,41.5
  Bottom 0.61: D12.7 54.35,45.73 53.47,44.86 51.14,44.86 50.37,45.63 45.13,45.63 v41,41.5
N$41  (via drill 0.5 pad 0.9)
  Top 0.61: IC2.11 46.09,41.59 v46,41.5
  Bottom 0.61: D12.4 47.69,41.5 v46,41.5
N$44  (via drill 0.5 pad 0.9)
  Top 0.61: IC2.12 47.37,43.02 47.36,43.03 47.36,43.14 v47,43.5
  Bottom 0.61: v47,43.5 46.38,43.5 44.19,41.31 D12.2
N$48  (via drill 0.5 pad 0.9)
  Top 0.61: IC2.13 48.63,43.37 v48.5,43.5
  Bottom 0.61: D12.1 41.65,40.17 46.13,44.64 47.47,44.64 48.5,43.62 v48.5,43.5
N$49  (via drill 0.5 pad 0.9)
  Top 0.61: IC2.14 49.91,43.41 v50,43.5
  Bottom 0.61: D12.10 48.17,51.52 54.95,51.52 55.79,50.67 55.79,45.27 54.02,43.5 v50,43.5
N$50
  Top 0.61: IC2.15 51.17,40.55 D12.5
N$51
  Top 0.61: IC2.16 53.25,41.46 53.25,39.33 52.41,38.48 48.17,38.48 D12.3
N$52  (via drill 0.5 pad 0.9)
  Top 0.61: IC2.1 52.45,46.55 v52.5,46.5
  Bottom 0.61: v52.5,46.5 51.75,47.25 44.48,47.25 D12.12
N$53
  Top 0.61: IC2.5 47.37,48.52 48.92,50.08 D12.9
N$54  (via drill 0.5 pad 0.9)
  Top 0.61: IC2.6 46.09,48.41 v46,48.5
  Bottom 0.61: v46,48.5 50.23,48.5 D12.8
N$121
  Top 1.27: D16.A 52.97,6.5 arc-90 RL2.1
  Top 2: RL3.1 18.18,6.35 arc-90 D15.A 18.02,6.96 arc-90 20.57,9.5 53,9.5 | RL1.1 82.17,6.35 arc-90 D17.A 82.03,6.96 arc90 79.48,9.5 53,9.5 | RL2.1 arc-90 53,6.47 53,9.5
  Bottom 2: Q1.C 92.37,32 arc-90 93.93,30.43 93.93,8.89 arc-90 91.39,6.35 RL1.1
R  (via drill 0.8 pad 1.6)
  Bottom 2: F1.1 2.25,25.5 2.25,5.75 v5.5,2.5
R_LED  (via drill 0.5 pad 0.9)
  Top 0.38: U2.26 68.58,44.92 67.5,46 67.5,46.5
  Top 0.61: v64,53.5 67.5,50 67.5,46.5
  Bottom 0.61: LED7.A 35.79,66.48 35.79,56.5 | LED4.A 35.79,51.52 35.79,56.5 | 35.79,56.5 35.91,56.39 52.89,56.39 53.86,57.36 60.14,57.36 v64,53.5
RA  (via drill 0.5 pad 0.9)
  Top 0.38: U2.8 71.83,33.31 72.43,32.7 72.43,32
  Top 0.61: 72.43,32 72.43,27.32 70.97,25.86 68.86,25.86 65,22 58.5,22 55.13,18.63 32.97,18.63 CT3.2 D9.1 | R22.1 v75.5,18.5 D8.A
  Bottom 0.61: CT3.2 30.61,25.21 49.79,25.21 51.39,23.61 70.39,23.61 v75.5,18.5
RELAY  (via drill 0.5 pad 0.9, 0.51)
  Top 0.38: U2.16 75.08,44.52 76.5,45.95
  Top 0.61: R32.2 v85.5,35.36 | v77.5,47 76.5,46 76.5,45.95
  Bottom 0.61: v77.5,47 80,44.5 80,38 82.64,35.36 v85.5,35.36
RF
  Top 0.61: V1.2 2.75,71.32 4.9,69.17 R5.2
  Bottom 1: F1.2 3.75,42.75 1.57,44.93 1.57,76.5 | 1.57,76.5 1.57,79.07 V1.2 | 1.57,76.5 13,76.5 26.38,89.88 53.62,89.88 TR1.5
RV
  Top 0.38: U2.12 74.42,34.35 76.4,32.38 76.4,32
  Top 0.61: R12.1 R15.2 R16.1 C1.2 2.1,48.1 1.79,47.8 D5.1 1.79,42.7 4,40.5 22,40.5 23,39.5 23,19.5 27.54,14.96 64.15,14.96 71.09,21.9 72.61,21.9 76.4,25.68 76.4,32
S_LED
  Top 0.38: U2.4 69.22,33.73 68.47,32.97 68.47,32
  Top 0.61: LED2.A 48,25.69 48.68,25.01 63.8,25.01 68.47,29.68 68.47,32
SCF  (via drill 0.5 pad 0.9, 0.51)
  Top 0.38: U2.7 71.17,33 71.44,32.73 71.44,32
  Top 0.61: 71.44,32 71.44,28.06 70.5,27.12 v70.5,27 | 91.12,21.6 91.12,14.19 90.3,13.37 R23.2 | 91.12,21.6 91.12,23.69 D10.1 89.5,26.91 v89.6,27 | D11.1 91.02,21.5 91.12,21.6
  Bottom 0.61: v70.5,27 v89.6,27
STOP  (1 unrouted)
  Top 0.38: U2.3 68.58,34.08 67.48,32.98 67.48,32
  Top 0.61: SW2.P$4 52.16,26 63.39,26 67.48,30.09 67.48,32
UPDI
  Top 0.38: 74.43,46.5 74.43,46.19 73.12,44.88 U2.19
  Top 0.61: 74.43,46.5 74.43,48 75.43,49 82.58,56.15 J1.1
V_DIS  (via drill 0.5 pad 0.9)
  Top 0.38: U2.24 69.88,45.62 69.48,46.02 69.48,46.5
  Top 0.61: IC2.3 49.91,45.69 51.59,44.01 56.13,44.01 56.13,44 60,44 v60.5,43.5 | 69.48,46.5 69.48,52.98 v69.5,53 68.5,54 R24.1
  Bottom 0.61: v69.5,53 69.5,52.5 v60.5,43.5
V_SCK  (via drill 0.5 pad 0.9)
  Top 0.38: U2.25 69.22,45.27 68.49,46.01 68.49,46.5
  Top 0.61: IC2.2 51.17,45.83 52,45 60,45 v60.5,45.5 | R26.1 65.5,54.5 v67,53 68.49,51.51 68.49,46.5
  Bottom 0.61: v67,53 60.5,46.5 v60.5,45.5
VCC  (via drill 0.5 pad 0.9, 0.51)  (2 unrouted)
  Top 0.38: 73.44,46.5 73.44,46.11 72.47,45.15 U2.20 72.47,38.98 71.6,38.1 C13.2 | U2.14 75.72,37 | 78.6,38 78.5,38
  Top 0.61: IC3.10 44.83,61.17 44,62 41.4,62 C14.2 | IC2.10 44.83,43.67 44.5,44 41.4,44 C15.2 | 73.44,46.5 73.44,48.94 80.04,55.54 J1.2
  Top 0.813: 78.6,38 C12.2 76.83,38.1 75.9,37.17 | R24.2 R26.2 R25.2 | R25.2 R27.2 | 84.5,45.92 IC1.OUT 84.46,52 86,53.54 86,66 83.5,68.5 v81.5,68.5 | 78.5,38 81.5,38 82.23,38.73 C7.+ | v36.5,74.5 v36.5,70.5 | C15.2 40.62,43.22 C10.+ | v71.5,61.5 R25.2
  Top 1.016: 40.9,61.5 C14.2 40.62,61.22 C11.+
  Bottom 0.813: IC1.OUT 84.46,43.46 82.23,41.23 C7.+ | 36.5,73.5 76.5,73.5 77.5,72.5 77.5,68.5 | 36.5,73.5 32.5,73.5 27.5,68.5 27.5,43.91 29.73,41.68 37.46,41.68 C10.+ | C11.+ 37.68,61.22 37.1,61.8 37.1,69.9 v36.5,70.5 | v36.5,74.5 36.5,73.5 | 77.5,68.5 73.5,68.5 71.5,66.5 v71.5,61.5 | 77.5,68.5 v81.5,68.5
VEE
  Top 0.762: 79,90.03 arc-90 80.27,88.76 X1.2
  Top 0.813: X1.2 80.27,86.73 80.7,86.3 D14.C | 79,90.03 21.93,90.03 R28.1
  Top 1.016: D14.C 81.7,83 91,83 91.78,82.22 91.78,80.22 C5.+ | IC1.IN 89.54,40.73 C6.+ 93.7,40.5 arc90 93.9,40.7
  Top 1.27: RL2.2 arc-90 43.11,6.5 D16.C
  Top 2: B1.+ 87.74,74.2 arc90 91.78,78.24 91.78,80.22 | RL3.2 13.82,6.35 arc90 D15.C 13.97,6.04 arc90 16.52,3.5 23,3.5 25.85,6.35 RL2.2 42.96,6.04 arc90 45.5,3.5 55,3.5 57.85,6.35 RL1.2 77.83,6.35 arc90 D17.C 77.97,5.54 arc90 80.52,3 90.96,3 arc90 93.9,5.94 93.9,40.7 93.9,67.38 arc90 C4.+
  Bottom 2: C5.+ C4.+
Y  (via drill 0.8 pad 1.6)
  Bottom 2: F2.1 15.23,22.52 arc-45 15.97,20.72 15.97,14.06 18.02,12.02 26.52,12.02 28.54,10 28.54,4.5 30.54,2.5 v37.5,2.5
Y_LED  (via drill 0.5 pad 0.9)
  Top 0.38: U2.27 67.92,44.58 66.51,45.99 66.51,46.5
  Top 0.61: v62.5,53 66.51,48.99 66.51,46.5
  Bottom 0.61: LED8.A 30,58.73 30,48 30.5,47.5 34.5,47.5 | v62.5,53 59.13,56.37 54.27,56.37 51.6,53.7 46.79,53.7 44.7,51.61 39.88,51.61 35.77,47.5 34.5,47.5 | LED5.A 34.27,47.27 34.5,47.5
YA  (via drill 0.5 pad 0.9, 0.51)
  Top 0.38: U2.9 72.47,33.56 73.42,32.61 73.42,32
  Top 0.61: R21.1 v75.5,15.5 D3.A | CT2.2 42.9,23.1 42,24 D4.1 | v66.5,22 69.37,24.87 71.38,24.87 73.42,26.91 73.42,32
  Bottom 0.61: CT2.2 48.48,22.62 66.5,22.62 | v75.5,15.5 68.38,22.62 66.5,22.62 | v66.5,22 66.5,22.62
YF
  Top 0.61: R6.2 11.9,69.6 8.75,72.75 V1.1
  Top 1: V2.2 10.75,76.25 V1.1
  Bottom 1: F2.2 10.75,41.25 4,48 4,69.5 V1.1
YV
  Top 0.38: U2.11 73.78,34.09 75.41,32.46 75.41,32
  Top 0.61: R13.1 R17.1 R18.1 C2.2 9.1,48.4 10.29,47.2 D6.1 10.29,43.7 12,42 23,42 24.5,40.5 24.5,20 28.35,16.15 61,16.15 62.45,17.61 65.39,17.61 70.68,22.89 72.2,22.89 75.41,26.09 75.41,32
(copper drawn outside any net)
  shapes: Top area x1

### Text on the board
Reference: BT AQ DOL R4